# EAGLE schematic rapidshark (EAGLE 6.5.0)
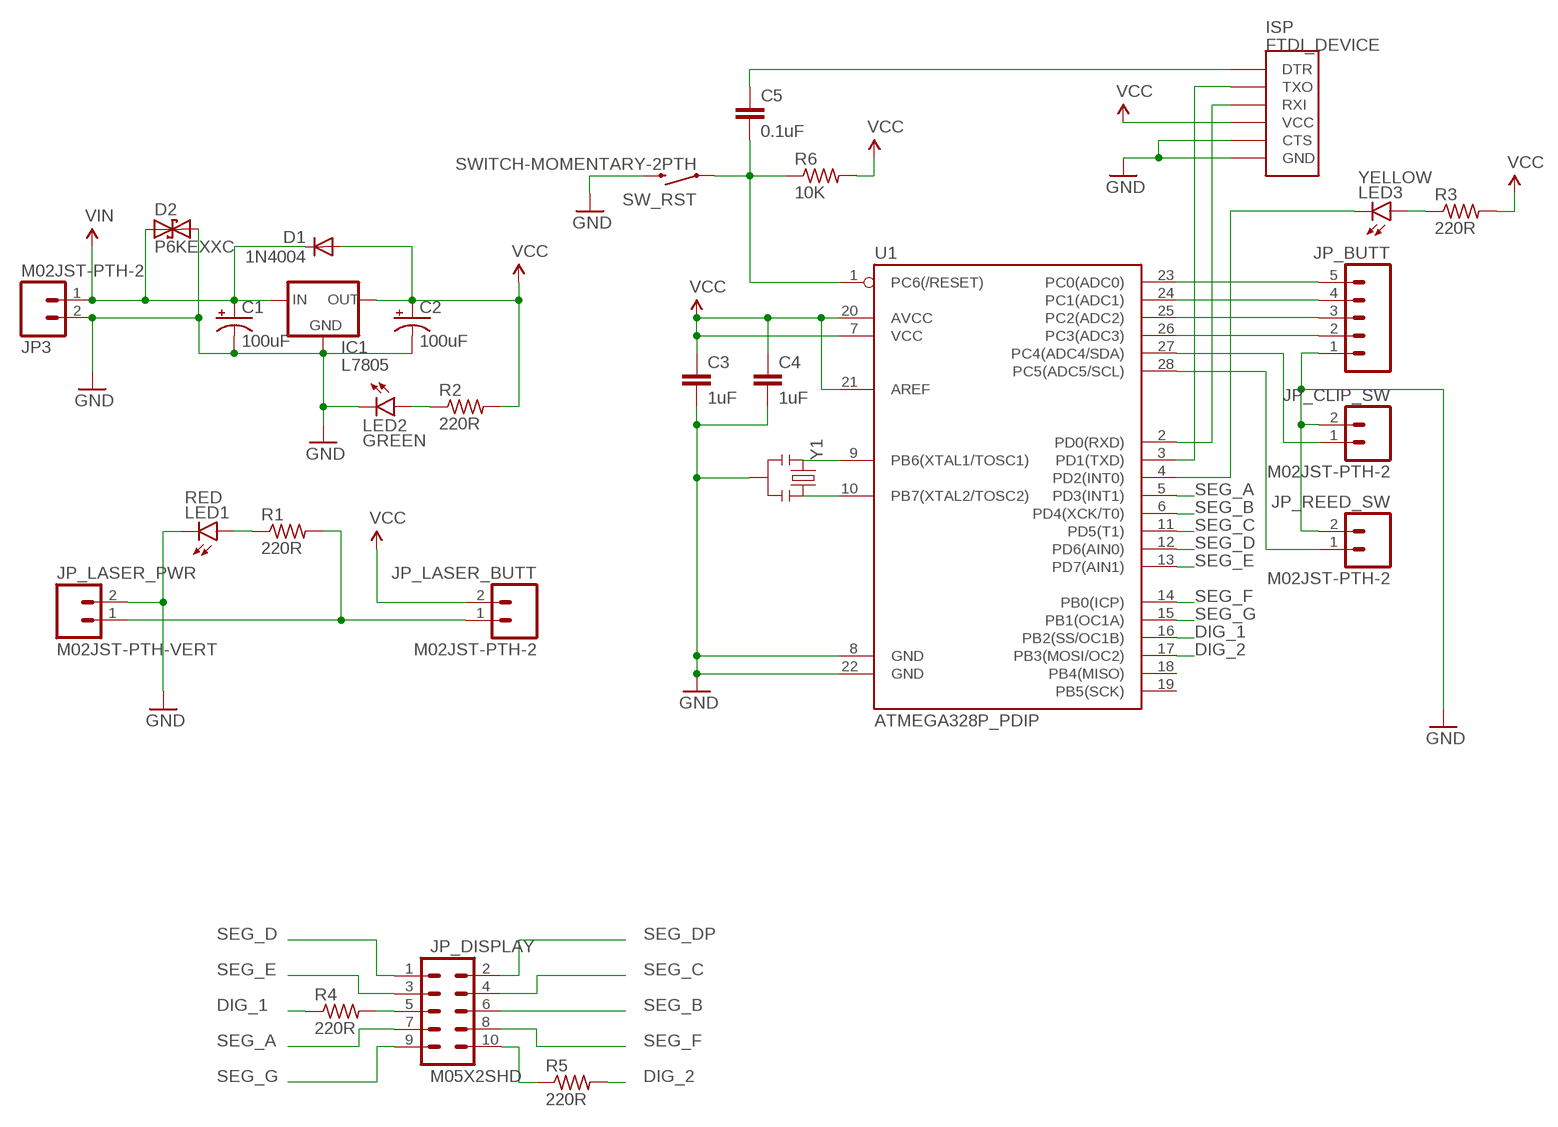
[diagram p0: schematic, sheet 1]

## Parts
C1  100uF  CPOL-USE2.5-6  [E2,5-6]
C2  100uF  CPOL-USE2.5-6  [E2,5-6]
C3  1uF  C-EU025-025X050  [C025-025X050]
C4  1uF  C-EU050-024X044  [C050-024X044]
C5  0.1uF  C-EU050-024X044  [C050-024X044]
D1  1N4004  [DO41-10]
D2  P6KEXXC  [CB417-15]
IC1  L7805  V_REG_78XX-TO-220  [TO-220-ALT]
ISP  FTDI_DEVICE  [FTDI_DEVICE_SIDE]
JP3  M02JST-PTH-2  [JST-2-PTH]
JP_BUTT  M05PTH  [1X05]
JP_CLIP_SW  M02JST-PTH-2  [JST-2-PTH]
JP_DISPLAY  M05X2SHD  [2X5-SHROUDED]
JP_LASER_BUTT  M02JST-PTH-2  [JST-2-PTH]
JP_LASER_PWR  M02JST-PTH-VERT  [JST-2-PTH-VERT]
JP_REED_SW  M02JST-PTH-2  [JST-2-PTH]
LED1  RED  LED3MM  [LED3MM]
LED2  GREEN  LED3MM  [LED3MM]
LED3  YELLOW  LED3MM  [LED3MM]
R1  220R  R-US_0204/7  [0204/7]
R2  220R  R-US_0204/7  [0204/7]
R3  220R  R-US_0204/7  [0204/7]
R4  220R  R-US_0204/7  [0204/7]
R5  220R  R-US_0204/7  [0204/7]
R6  10K  R-US_0204/7  [0204/7]
SW_RST  SWITCH-MOMENTARY-2PTH  [TACTILE-PTH]
U1  ATMEGA328P_PDIP  [DIL28-3]
Y1  RESONATORPTH  [RESONATOR-PTH]

## Nets
DIG_1: R4.1 U1.16(PB2(SS/OC1B))
DIG_2: R5.2 U1.17(PB3(MOSI/OC2))
GND: C1.- C2.- C3.2 C4.2 D2.C IC1.GND ISP.P$5(CTS) ISP.P$6(GND) JP3.2 JP_BUTT.1 JP_CLIP_SW.2 JP_LASER_PWR.2 JP_REED_SW.2 LED1.K(C) LED2.K(C) SW_RST.3 U1.8(GND) U1.22(GND) Y1.2
N$1: U1.9(PB6(XTAL1/TOSC1)) Y1.3
N$2: C5.2 R6.1 SW_RST.1 U1.1(PC6(/RESET))
N$3: U1.10(PB7(XTAL2/TOSC2)) Y1.1
N$4: LED2.A R2.1
N$5: C5.1 ISP.P$1(DTR)
N$6: ISP.P$2(TXO) U1.3(PD1(TXD))
N$7: ISP.P$3(RXI) U1.2(PD0(RXD))
N$9: JP_DISPLAY.5 R4.2
N$13: JP_DISPLAY.10 R5.1
N$19: JP_LASER_BUTT.1 JP_LASER_PWR.1 R1.2
N$20: JP_BUTT.5 U1.23(PC0(ADC0))
N$21: JP_BUTT.4 U1.24(PC1(ADC1))
N$22: JP_BUTT.3 U1.25(PC2(ADC2))
N$23: JP_BUTT.2 U1.26(PC3(ADC3))
N$24: LED1.A R1.1
N$27: JP_CLIP_SW.1 U1.27(PC4(ADC4/SDA))
N$28: JP_REED_SW.1 U1.28(PC5(ADC5/SCL))
N$29: LED3.A R3.1
N$30: LED3.K(C) U1.4(PD2(INT0))
SEG_A: JP_DISPLAY.7 U1.5(PD3(INT1))
SEG_B: JP_DISPLAY.6 U1.6(PD4(XCK/T0))
SEG_C: JP_DISPLAY.4 U1.11(PD5(T1))
SEG_D: JP_DISPLAY.1 U1.12(PD6(AIN0))
SEG_DP: JP_DISPLAY.2
SEG_E: JP_DISPLAY.3 U1.13(PD7(AIN1))
SEG_F: JP_DISPLAY.8 U1.14(PB0(ICP))
SEG_G: JP_DISPLAY.9 U1.15(PB1(OC1A))
VCC: C2.+ C3.1 C4.1 D1.A IC1.OUT ISP.P$4(VCC) JP_LASER_BUTT.2 R2.2 R3.2 R6.2 U1.7(VCC) U1.20(AVCC) U1.21(AREF)
VIN: C1.+ D1.C D2.A IC1.IN JP3.1
Unconnected: U1.18(PB4(MISO)) U1.19(PB5(SCK))

## Library data of the parts
C1 C2 = rcl:CPOL-US: POLARIZED CAPACITOR, American symbol
C3-C5 = rcl:C-EU: CAPACITOR, European symbol
D1 = diode:1N4004: DIODE general purpose rectifier, 1 A
D2 = diode:P6KEXXC: DIODE transient-voltage suppressor
IC1 = SparkFun-PowerIC:V_REG_78XX: Voltage Regulator Standard 7805 5V regulator. IGO (Input Ground Output). Spark Fun Electronics SKU : COM-00107
ISP = SparkFun-Connectors:FTDI_DEVICE: Connector which mates to FTDI basic or FTDI cable.
JP3 JP_CLIP_SW JP_LASER_BUTT JP_REED_SW = SparkFun-Connectors:M02: Standard 2-pin 0.1" header. Use with - straight break away headers ( PRT-00116) - right angle break away headers (PRT-00553) - swiss pins (PRT-00743) - machine pins (PRT-00117) - female headers (PRT-00115) Molex polarized connector foot print use with: PRT-08233 with associated crimp pins and housings. 2.54_SCREWTERM for use with PRT-10571. 3.5mm Screw Terminal footprints for PRT-08084 5mm Screw Terminal footprints for use with PRT-08433; SKU: PRT-09914
JP_BUTT = SparkFun-Connectors:M05: Header 5 Standard 5-pin 0.1" header. Use with straight break away headers (SKU : PRT-00116), right angle break away headers (PRT-00553), swiss pins (PRT-00743), machine pins (PRT-00117), and female headers (PRT-00115). Molex polarized connector foot print use with SKU : PRT-08230 with associated crimp pins and housings.
JP_DISPLAY = SparkFun-Connectors:M05X2: Header 5x2 Standard 10-pin dual row 0.1" header. Commonly used with AVR-ISP. Use with Spark Fun Electronics SKU: PRT-00778
JP_LASER_PWR = SparkFun-Connectors:M02: Standard 2-pin 0.1" header. Use with - straight break away headers ( PRT-00116) - right angle break away headers (PRT-00553) - swiss pins (PRT-00743) - machine pins (PRT-00117) - female headers (PRT-00115) Molex polarized connector foot print use with: PRT-08233 with associated crimp pins and housings. 2.54_SCREWTERM for use with PRT-10571. 3.5mm Screw Terminal footprints for PRT-08084 5mm Screw Terminal footprints for use with PRT-08433
LED1-LED3 = SparkFun-LED:LED: LEDs Standard schematic elements and footprints for 5mm, 3mm, 1206, and 0603 sized LEDs. 5mm - Spark Fun Electronics SKU : COM-00529 (and others)
R1-R6 = rcl:R-US_: RESISTOR, American symbol
SW_RST = SparkFun-Electromechanical:SWITCH-MOMENTARY-2: Various NO switches- pushbuttons, reed, etc
U1 = SparkFun-DigitalIC:ATMEGA328P_PDIP: uC used in the Arduino 32kb flash, 1k EEPROM, 2k SRAM This is the through-hole version of this chip.
Y1 = SparkFun-FreqCtrl:RESONATOR: Resonator Small SMD resonator. Used, eg, on the Arduino Pro/ Pro Mini boards. 8MHz- XTAL-08895 16MHz- XTAL-08900